# Altium schematic sheet NBT_CPU51.SCHDOC
size A4; Organization: Altium Limited; Address1: L3, 12a Rodborough Rd; Address2: Frenchs Forest; Address3: NSW; Address4: Australia 2086; DocumentNumber: 2; SheetNumber: 2; SheetTotal: 12
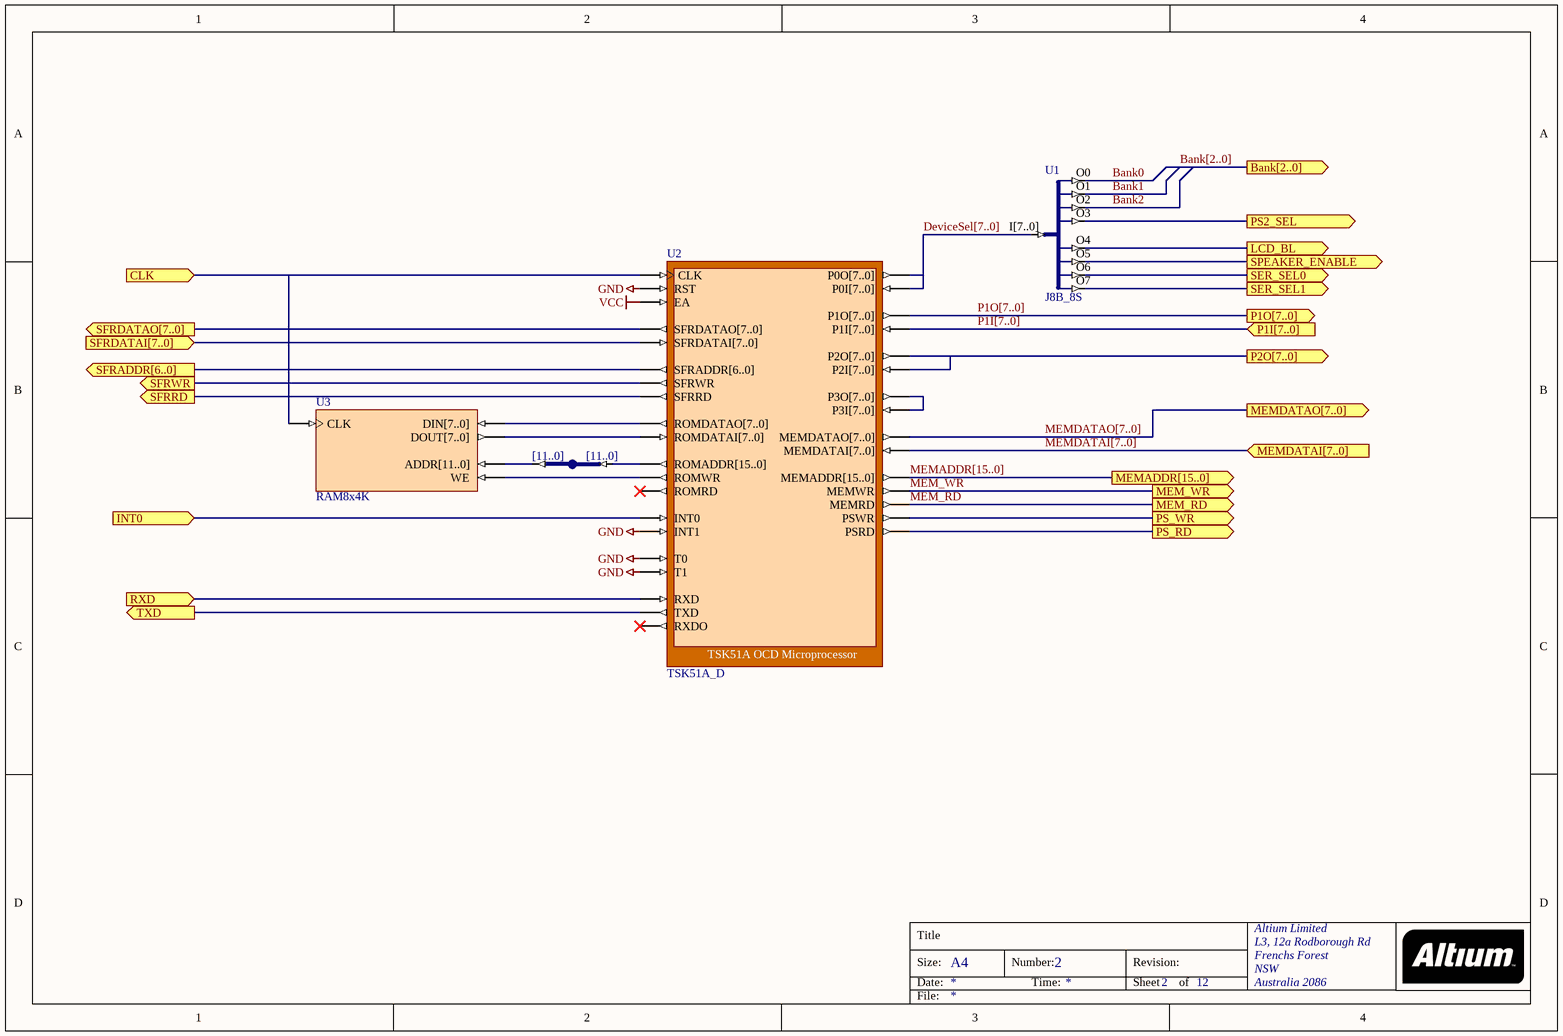
[diagram p0: NBT_CPU51.SCHDOC]

## Parts
JB_S1  IndexA: [11..0]  (hidden comment: JB)
U1  J8B_8S
U2  TSK51A_D
U3  RAM8x4K

## Ports
Bank[2..0] (out), CLK (in), INT0 (in), LCD_BL (out), MEM_RD (out), MEM_WR (out), MEMADDR[15..0] (out), MEMDATAI[7..0] (in), MEMDATAO[7..0] (out), P1I[7..0] (in), P1O[7..0] (out), P2O[7..0] (out), PS2_SEL (out), PS_RD (out), PS_WR (out), RXD (in), SER_SEL0 (out), SER_SEL1 (out), SFRADDR[6..0] (out), SFRDATAI[7..0] (in), SFRDATAO[7..0] (out), SFRRD (out), SFRWR (out), SPEAKER_ENABLE (out), TXD (out)

## Nets
GND: U2.INT1 U2.RST U2.T0 U2.T1
VCC: U2.EA
Bank0: U1.O0
Bank1: U1.O1
Bank2: U1.O2
CLK: U2.CLK U3.CLK ; port CLK
DeviceSel[7..0]: U1.I[7..0] U2.P0I[7..0] U2.P0O[7..0]
INT0: U2.INT0 ; port INT0
LCD_BL: U1.O4 ; port LCD_BL
MEM_RD: U2.MEMRD ; port MEM_RD
MEM_WR: U2.MEMWR ; port MEM_WR
MEMADDR[15..0]: U2.MEMADDR[15..0] ; port MEMADDR[15..0]
MEMDATAI[7..0]: U2.MEMDATAI[7..0] ; port MEMDATAI[7..0]
MEMDATAO[7..0]: U2.MEMDATAO[7..0] ; port MEMDATAO[7..0]
P1I[7..0]: U2.P1I[7..0] ; port P1I[7..0]
P1O[7..0]: U2.P1O[7..0] ; port P1O[7..0]
P2O[7..0]: U2.P2I[7..0] U2.P2O[7..0] ; port P2O[7..0]
PS2_SEL: U1.O3 ; port PS2_SEL
PS_RD: U2.PSRD ; port PS_RD
PS_WR: U2.PSWR ; port PS_WR
RXD: U2.RXD ; port RXD
SER_SEL0: U1.O6 ; port SER_SEL0
SER_SEL1: U1.O7 ; port SER_SEL1
SFRADDR[6..0]: U2.SFRADDR[6..0] ; port SFRADDR[6..0]
SFRDATAI[7..0]: U2.SFRDATAI[7..0] ; port SFRDATAI[7..0]
SFRDATAO[7..0]: U2.SFRDATAO[7..0] ; port SFRDATAO[7..0]
SFRRD: U2.SFRRD ; port SFRRD
SFRWR: U2.SFRWR ; port SFRWR
SPEAKER_ENABLE: U1.O5 ; port SPEAKER_ENABLE
TXD: U2.TXD ; port TXD
NetJB_S1_A[0..0]: JB_S1.A[0..0](IA[0..0]) U3.ADDR[11..0]
NetJB_S1_B[0..0]: JB_S1.B[0..0] U2.ROMADDR[15..0]
NetU2_P3I[7..0]: U2.P3I[7..0] U2.P3O[7..0]
NetU2_ROMDATAI[7..0]: U2.ROMDATAI[7..0] U3.DOUT[7..0]
NetU2_ROMDATAO[7..0]: U2.ROMDATAO[7..0] U3.DIN[7..0]
NetU2_ROMWR: U2.ROMWR U3.WE

Not connected (* = marked no-connect by the designer): U2 ROMRD* RXDO*

## Buses and harness runs
bus Bank[2..0] = port Bank[2..0]
bus DeviceSel[7..0]
bus MEMADDR[15..0] = port MEMADDR[15..0]
bus MEMDATAI[7..0] = port MEMDATAI[7..0]
bus MEMDATAO[7..0] = port MEMDATAO[7..0]
bus P1I[7..0] = port P1I[7..0]
bus P1O[7..0] = port P1O[7..0]

## Notes on the sheet
- Title
- Size:
- Date:
- A4
- Number:
- Time:
- Revision:
- Sheet
- of
- File:

## Library data of the parts
JB_S1 = JB: System Joiner; Class I: Bus Joiner; ArchiveName: GENERIC; Published: 18-Sep-2003; Publisher: Altium Limited; IndexB: [11..0]
U1 = J8B_8S: 8-Bit input bus to 8 single pin outputs; ArchiveName: GENERIC; Published: 7-Nov-2003; Publisher: Altium Limited; Core Revision: 1.00.00
U2 = TSK51A_D: TSK51A OCD Microprocessor; NEXUS_CORE: Processor_OCDS; NEXUS_JTAG_DEVICE: True; NEXUS_JTAG_ORDER: 0; ChildModel1: RAM256x8_TSK51D; Memory_Configuration: Record[NEXUS_CORE]{}ComponentDesignator[iram]{}Memory_Depth[256]{}Memory_UsageType[ram]{}ProgramDownloadAddress[0x0]{}Memory_BusType[c51:idata_bus]{n}Record[NEXUS_CORE]{}ComponentDesignator[xram]{}Memory_Depth[32k]{}Memory_UsageType[ram]{}ProgramDownloadAddress[0x0000]{}Memory_BusType[c51:xdata_bus]{n}Record[NEXUS_CORE]{}ComponentDesignator[xrom]{}Memory_Depth[32k]{}Memory_UsageType[rom]{}ProgramDownloadAddress[0x0000]{}Memory_BusType[c51:code_bus]{n}; Published: 10/11/2003; Publisher: Altium Hobart Technology Centre; Core Revision: 1.00.00
U3 = RAM8x4K: Single Port Random Access Memory 4096 x 8; Memory_Depth: 4096; Memory_Type: RAM_SinglePortBlock; Memory_Width: 8; Memory_ClockEdge: Rising; Nexus_Core: Memory_Program; Published: 26/09/2003; Publisher: Altium Hobart Technology Center